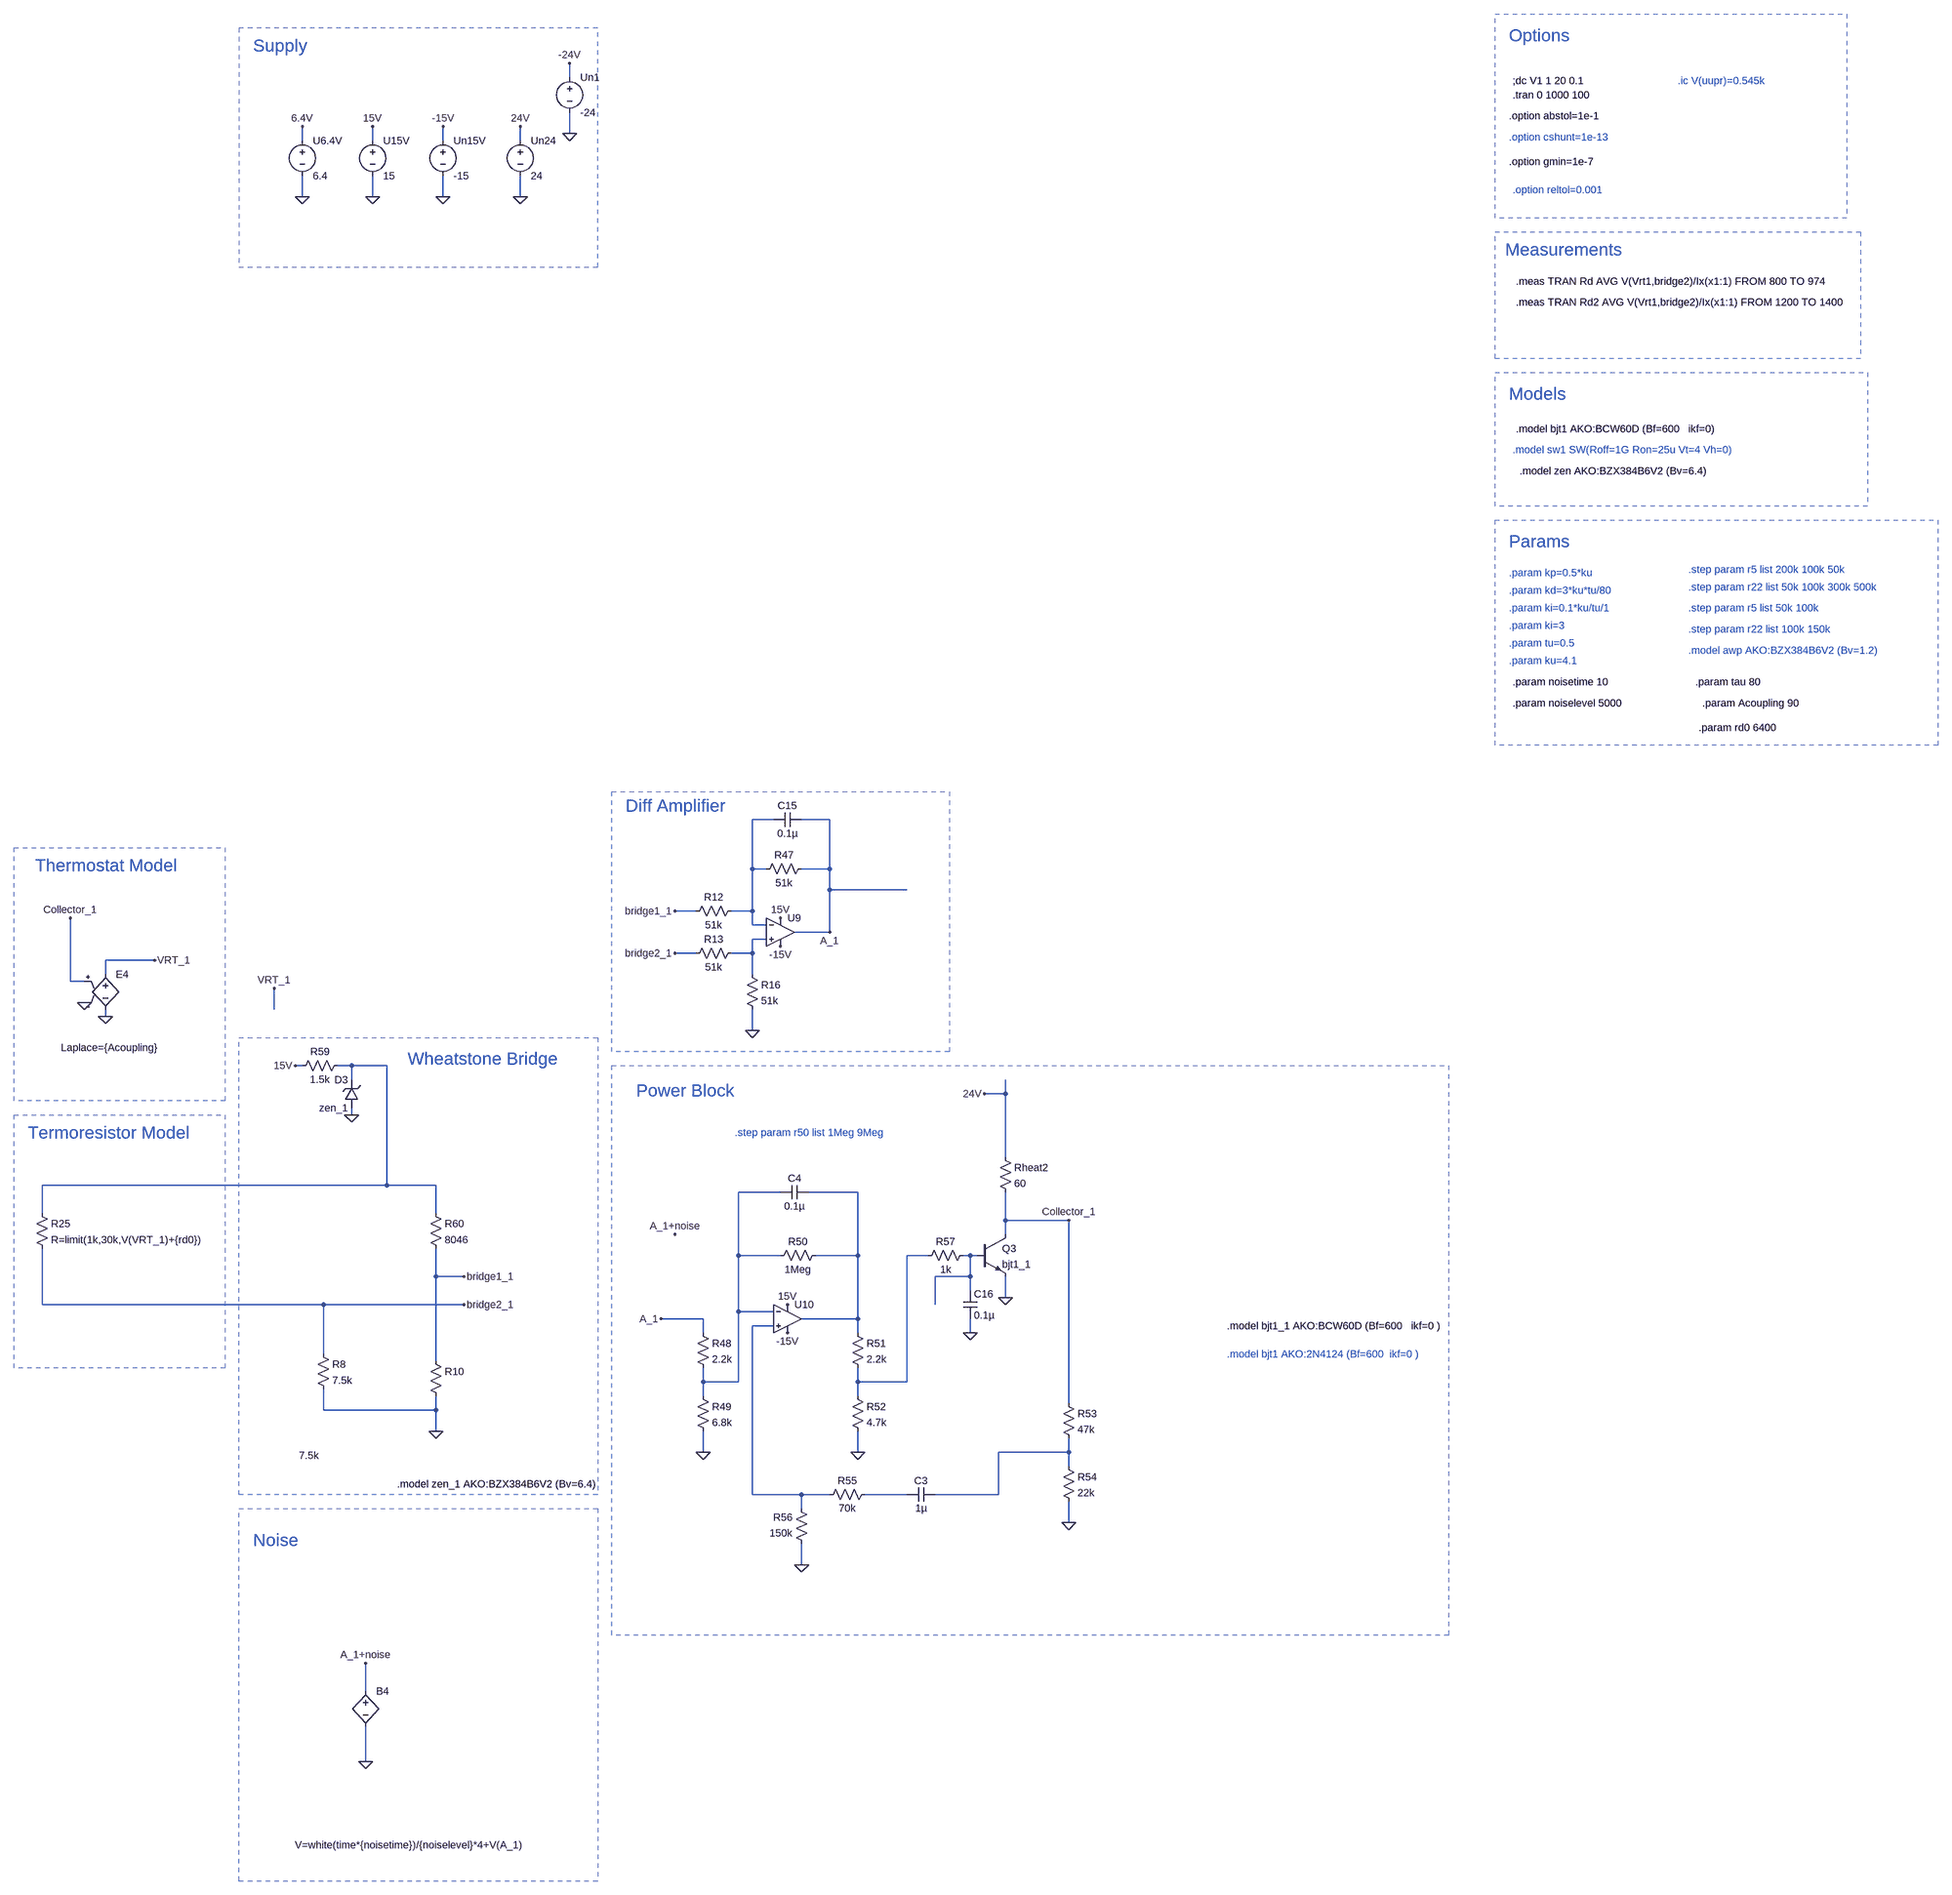
[diagram p0: schematic static.asc]
static.asc, the LTspice schematic file:
Version 4
SHEET 1 2196 8900
WIRE -1120 -672 -1120 -704
WIRE -1120 -544 -1120 -592
WIRE -1728 -528 -1728 -560
WIRE -1568 -528 -1568 -560
WIRE -1408 -528 -1408 -560
WIRE -1232 -528 -1232 -560
WIRE -1728 -400 -1728 -448
WIRE -1568 -400 -1568 -448
WIRE -1408 -400 -1408 -448
WIRE -1232 -400 -1232 -448
WIRE -656 3696 -704 3696
WIRE -528 3696 -592 3696
WIRE -704 3808 -704 3696
WIRE -672 3808 -704 3808
WIRE -528 3808 -528 3696
WIRE -528 3808 -592 3808
WIRE -528 3856 -528 3808
WIRE -352 3856 -528 3856
WIRE -832 3904 -880 3904
WIRE -704 3904 -704 3808
WIRE -704 3904 -752 3904
WIRE -704 3936 -704 3904
WIRE -672 3936 -704 3936
WIRE -528 3952 -528 3856
WIRE -528 3952 -608 3952
WIRE -672 3968 -704 3968
WIRE -832 4000 -880 4000
WIRE -704 4000 -704 3968
WIRE -704 4000 -752 4000
WIRE -2064 4016 -2176 4016
WIRE -2176 4048 -2176 4016
WIRE -704 4048 -704 4000
WIRE -2256 4064 -2256 3920
WIRE -2224 4064 -2256 4064
WIRE -1792 4128 -1792 4080
WIRE -2176 4144 -2176 4128
WIRE -704 4176 -704 4128
WIRE -1728 4256 -1744 4256
WIRE -1616 4256 -1648 4256
WIRE -1536 4256 -1616 4256
WIRE -1616 4288 -1616 4256
WIRE -128 4320 -128 4288
WIRE -128 4320 -176 4320
WIRE -1616 4368 -1616 4352
WIRE -128 4464 -128 4320
WIRE -1536 4528 -1536 4256
WIRE -1536 4528 -2320 4528
WIRE -1424 4528 -1536 4528
WIRE -640 4544 -736 4544
WIRE -464 4544 -576 4544
WIRE -2320 4592 -2320 4528
WIRE -1424 4592 -1424 4528
WIRE -128 4608 -128 4544
WIRE 16 4608 -128 4608
WIRE -128 4640 -128 4608
WIRE -736 4688 -736 4544
WIRE -640 4688 -736 4688
WIRE -464 4688 -464 4544
WIRE -464 4688 -560 4688
WIRE -304 4688 -352 4688
WIRE -208 4688 -224 4688
WIRE -192 4688 -208 4688
WIRE -1424 4736 -1424 4672
WIRE -1360 4736 -1424 4736
WIRE -208 4736 -208 4688
WIRE -208 4736 -288 4736
WIRE -208 4768 -208 4736
WIRE -128 4784 -128 4736
WIRE -2320 4800 -2320 4672
WIRE -1680 4800 -2320 4800
WIRE -1360 4800 -1680 4800
WIRE -288 4800 -288 4736
WIRE -736 4816 -736 4688
WIRE -656 4816 -736 4816
WIRE -816 4832 -912 4832
WIRE -464 4832 -464 4688
WIRE -464 4832 -592 4832
WIRE -656 4848 -704 4848
WIRE -816 4864 -816 4832
WIRE -464 4864 -464 4832
WIRE -208 4864 -208 4832
WIRE -1680 4912 -1680 4800
WIRE -1424 4928 -1424 4736
WIRE -816 4976 -816 4944
WIRE -736 4976 -736 4816
WIRE -736 4976 -816 4976
WIRE -464 4976 -464 4944
WIRE -352 4976 -352 4688
WIRE -352 4976 -464 4976
WIRE -816 5008 -816 4976
WIRE -464 5008 -464 4976
WIRE 16 5024 16 4608
WIRE -1680 5040 -1680 4992
WIRE -1424 5040 -1424 5008
WIRE -1424 5040 -1680 5040
WIRE -1424 5088 -1424 5040
WIRE -816 5136 -816 5088
WIRE -464 5136 -464 5088
WIRE 16 5136 16 5104
WIRE 16 5136 -144 5136
WIRE 16 5168 16 5136
WIRE -704 5232 -704 4848
WIRE -592 5232 -704 5232
WIRE -528 5232 -592 5232
WIRE -352 5232 -448 5232
WIRE -144 5232 -144 5136
WIRE -144 5232 -288 5232
WIRE -592 5264 -592 5232
WIRE 16 5296 16 5248
WIRE -592 5392 -592 5344
WIRE -1584 5680 -1584 5616
WIRE -1584 5840 -1584 5760
FLAG -1728 -400 0
FLAG -1728 -560 6.4V
FLAG -1568 -400 0
FLAG -1568 -560 15V
FLAG -1408 -400 0
FLAG -1408 -560 -15V
FLAG -1232 -400 0
FLAG -1232 -560 24V
FLAG -1424 5088 0
FLAG -640 3920 15V
FLAG -640 3984 -15V
FLAG -704 4176 0
FLAG -816 5136 0
FLAG -624 4864 -15V
FLAG -624 4800 15V
FLAG -464 5136 0
FLAG -128 4784 0
FLAG 16 5296 0
FLAG -592 5392 0
FLAG -208 4864 0
FLAG -1360 4736 bridge1_1
FLAG -1360 4800 bridge2_1
FLAG -880 3904 bridge1_1
FLAG -880 4000 bridge2_1
FLAG -528 3952 A_1
FLAG -912 4832 A_1
FLAG 16 4608 Collector_1
FLAG -2224 4112 0
FLAG -1792 4080 VRT_1
FLAG -2176 4144 0
FLAG -2064 4016 VRT_1
FLAG -2256 3920 Collector_1
FLAG -1744 4256 15V
FLAG -1616 4368 0
FLAG -176 4320 24V
FLAG -1584 5840 0
FLAG -1584 5616 A_1+noise
FLAG -880 4640 A_1+noise
FLAG -1120 -544 0
FLAG -1120 -704 -24V
DATAFLAG -400 3856 ""
DATAFLAG -816 4976 ""
DATAFLAG 16 5136 ""
SYMBOL voltage -1728 -544 R0
WINDOW 123 0 0 Left 0
WINDOW 39 0 0 Left 0
SYMATTR InstName U6.4V
SYMATTR Value 6.4
SYMBOL voltage -1568 -544 R0
WINDOW 123 0 0 Left 0
WINDOW 39 0 0 Left 0
SYMATTR InstName U15V
SYMATTR Value 15
SYMBOL voltage -1408 -544 R0
WINDOW 123 0 0 Left 0
WINDOW 39 0 0 Left 0
SYMATTR InstName Un15V
SYMATTR Value -15
SYMBOL voltage -1232 -544 R0
WINDOW 123 0 0 Left 0
WINDOW 39 0 0 Left 0
SYMATTR InstName Un24
SYMATTR Value 24
SYMBOL res -1696 4896 R0
SYMATTR InstName R8
SYMATTR Value 7.5k
SYMBOL res -1440 4912 R0
WINDOW 3 -296 231 Left 2
SYMATTR Value 7.5k
SYMATTR InstName R10
SYMBOL res -736 3888 R90
WINDOW 0 0 56 VBottom 2
WINDOW 3 32 56 VTop 2
SYMATTR InstName R12
SYMATTR Value 51k
SYMBOL res -736 3984 R90
WINDOW 0 0 56 VBottom 2
WINDOW 3 32 56 VTop 2
SYMATTR InstName R13
SYMATTR Value 51k
SYMBOL res -720 4032 R0
SYMATTR InstName R16
SYMATTR Value 51k
SYMBOL res -576 3792 R90
WINDOW 0 0 56 VBottom 2
WINDOW 3 32 56 VTop 2
SYMATTR InstName R47
SYMATTR Value 51k
SYMBOL res -832 4848 R0
SYMATTR InstName R48
SYMATTR Value 2.2k
SYMBOL res -832 4992 R0
SYMATTR InstName R49
SYMATTR Value 6.8k
SYMBOL res -544 4672 R90
WINDOW 0 0 56 VBottom 2
WINDOW 3 32 56 VTop 2
SYMATTR InstName R50
SYMATTR Value 1Meg
SYMBOL res -480 4848 R0
SYMATTR InstName R51
SYMATTR Value 2.2k
SYMBOL res -480 4992 R0
SYMATTR InstName R52
SYMATTR Value 4.7k
SYMBOL res -144 4448 R0
SYMATTR InstName Rheat2
SYMATTR Value 60
SYMBOL res 0 5008 R0
SYMATTR InstName R53
SYMATTR Value 47k
SYMBOL res 0 5152 R0
SYMATTR InstName R54
SYMATTR Value 22k
SYMBOL res -432 5216 R90
WINDOW 0 0 56 VBottom 2
WINDOW 3 32 56 VTop 2
SYMATTR InstName R55
SYMATTR Value 70k
SYMBOL res -576 5360 R180
WINDOW 0 36 76 Left 2
WINDOW 3 36 40 Left 2
SYMATTR InstName R56
SYMATTR Value 150k
SYMBOL res -208 4672 R90
WINDOW 0 0 56 VBottom 2
WINDOW 3 32 56 VTop 2
SYMATTR InstName R57
SYMATTR Value 1k
SYMBOL cap -288 5216 R90
WINDOW 0 0 32 VBottom 2
WINDOW 3 32 32 VTop 2
SYMATTR InstName C3
SYMATTR Value 1µ
SYMBOL cap -576 4528 R90
WINDOW 0 0 32 VBottom 2
WINDOW 3 32 32 VTop 2
SYMATTR InstName C4
SYMATTR Value 0.1µ
SYMBOL cap -592 3680 R90
WINDOW 0 0 32 VBottom 2
WINDOW 3 32 32 VTop 2
SYMATTR InstName C15
SYMATTR Value 0.1µ
SYMBOL cap -224 4768 R0
SYMATTR InstName C16
SYMATTR Value 0.1µ
SYMBOL e -2176 4032 R0
WINDOW 3 -101 183 Left 2
SYMATTR Value Laplace={Acoupling}
SYMATTR InstName E4
SYMBOL zener -1600 4352 R180
WINDOW 0 24 64 Left 2
WINDOW 3 24 0 Left 2
SYMATTR InstName D3
SYMATTR Value zen_1
SYMBOL res -1632 4240 R90
WINDOW 0 0 56 VBottom 2
WINDOW 3 32 56 VTop 2
SYMATTR InstName R59
SYMATTR Value 1.5k
SYMBOL npn -192 4640 R0
SYMATTR InstName Q3
SYMATTR Value bjt1_1
SYMBOL res -2336 4576 R0
SYMATTR InstName R25
SYMATTR Value R=limit(1k,30k,V(VRT_1)+{rd0})
SYMBOL res -1440 4576 R0
SYMATTR InstName R60
SYMATTR Value 8046
SYMBOL bv -1584 5664 R0
WINDOW 3 -161 366 Left 2
SYMATTR Value V=white(time*{noisetime})/{noiselevel}*4+V(A_1)
SYMATTR InstName B4
SYMBOL Opamps\\UniversalOpamp2 -640 3952 R0
SYMATTR InstName U9
SYMATTR Value2 Avol=250k GBW=10Meg Slew=10Meg
SYMBOL Opamps\\UniversalOpamp2 -624 4832 R0
SYMATTR InstName U10
SYMATTR Value2 Avol=250k GBW=10Meg Slew=10Meg
SYMBOL voltage -1120 -688 R0
WINDOW 123 0 0 Left 0
WINDOW 39 0 0 Left 0
SYMATTR InstName Un1
SYMATTR Value -24
TEXT 1224 -632 Left 2 !.tran 0 1000 100
TEXT -1840 -744 Left 4 ;Supply
TEXT 1224 176 Left 2 ;.model sw1 SW(Roff=1G Ron=25u Vt=4 Vh=0)
TEXT 1216 456 Left 2 ;.param kp=0.5*ku
TEXT 1216 496 Left 2 ;.param kd=3*ku*tu/80
TEXT 1216 536 Left 2 ;.param ki=0.1*ku/tu/1
TEXT 1216 616 Left 2 ;.param tu=0.5
TEXT 1216 656 Left 2 ;.param ku=4.1
TEXT 1216 576 Left 2 ;.param ki=3
TEXT 1600 -664 Left 2 ;.ic V(uupr)=0.545k
TEXT 1232 128 Left 2 !.model bjt1 AKO:BCW60D (Bf=600   ikf=0)
TEXT 1240 224 Left 2 !.model zen AKO:BZX384B6V2 (Bv=6.4)
TEXT 1224 -664 Left 2 !;dc V1 1 20 0.1
TEXT 1216 -584 Left 2 !.option abstol=1e-1
TEXT 1216 -536 Left 2 ;.option cshunt=1e-13
TEXT 1216 -480 Left 2 !.option gmin=1e-7
TEXT 1224 -416 Left 2 ;.option reltol=0.001
TEXT 1624 632 Left 2 ;.model awp AKO:BZX384B6V2 (Bv=1.2)
TEXT 1232 -208 Left 2 !.meas TRAN Rd AVG V(Vrt1,bridge2)/Ix(x1:1) FROM 800 TO 974
TEXT 1232 -160 Left 2 !.meas TRAN Rd2 AVG V(Vrt1,bridge2)/Ix(x1:1) FROM 1200 TO 1400
TEXT -1488 4240 Left 4 ;Wheatstone Bridge
TEXT -992 3664 Left 4 ;Diff Amplifier
TEXT -2336 3800 Left 4 ;Thermostat Model
TEXT -968 4312 Left 4 ;Power Block
TEXT 376 4848 Left 2 !.model bjt1_1 AKO:BCW60D (Bf=600   ikf=0 )
TEXT -1512 5208 Left 2 !.model zen_1 AKO:BZX384B6V2 (Bv=6.4)
TEXT 376 4912 Left 2 ;.model bjt1 AKO:2N4124 (Bf=600  ikf=0 )
TEXT 1624 448 Left 2 ;.step param r5 list 200k 100k 50k
TEXT 1624 488 Left 2 ;.step param r22 list 50k 100k 300k 500k
TEXT 1624 584 Left 2 ;.step param r22 list 100k 150k
TEXT 1624 536 Left 2 ;.step param r5 list 50k 100k
TEXT 1208 -280 Left 4 ;Measurements
TEXT 1216 -768 Left 4 ;Options
TEXT 1216 48 Left 4 ;Models
TEXT 1216 384 Left 4 ;Params
TEXT -2352 4408 Left 4 ;Termoresistor Model
TEXT 1224 704 Left 2 !.param noisetime 10
TEXT 1224 752 Left 2 !.param noiselevel 5000
TEXT -1840 5336 Left 4 ;Noise
TEXT -744 4408 Left 2 ;.step param r50 list 1Meg 9Meg
TEXT 1640 704 Left 2 !.param tau 80
TEXT 1656 752 Left 2 !.param Acoupling 90
TEXT 1648 808 Left 2 !.param rd0 6400
RECTANGLE Normal -1056 -784 -1872 -240 2
RECTANGLE Normal -1056 5232 -1872 4192 2
RECTANGLE Normal -256 4224 -1024 3632 2
RECTANGLE Normal -1904 4944 -2384 4368 2
RECTANGLE Normal -1904 4336 -2384 3760 2
RECTANGLE Normal 880 5552 -1024 4256 2
RECTANGLE Normal 2016 -32 1184 -320 2
RECTANGLE Normal 1984 -352 1184 -816 2
RECTANGLE Normal 2032 304 1184 0 2
RECTANGLE Normal 2192 848 1184 336 2
RECTANGLE Normal -1056 6112 -1872 5264 2

The netlist it stands for:
* static.asc
V§U6.4V 6.4V 0 6.4
V§U15V 15V 0 15
V§Un15V -15V 0 -15
V§Un24 24V 0 24
R8 bridge2_1 0 7.5k
R10 bridge1_1 0 7.5k
R12 N001 bridge1_1 51k
R13 N002 bridge2_1 51k
R16 N002 0 51k
R47 A_1 N001 51k
R48 A_1 N004 2.2k
R49 N004 0 6.8k
R50 N005 N004 1Meg
R51 N005 N006 2.2k
R52 N006 0 4.7k
Rheat2 24V Collector_1 60
R53 Collector_1 N009 47k
R54 N009 0 22k
R55 N010 N008 70k
R56 0 N008 150k
R57 N007 N006 1k
C3 N009 N010 1µ
C4 N005 N004 0.1µ
C15 A_1 N001 0.1µ
C16 N007 0 0.1µ
E4 VRT_1 0 Collector_1 0 Laplace={Acoupling}
D3 0 N003 zen_1
R59 N003 15V 1.5k
Q3 Collector_1 N007 0 0 bjt1_1
R25 N003 bridge2_1 R=limit(1k,30k,V(VRT_1)+{rd0})
R60 N003 bridge1_1 8046
B4 A_1+noise 0 V=white(time*{noisetime})/{noiselevel}*4+V(A_1)
XU9 N002 N001 15V -15V A_1 level.2 Avol=250k GBW=10Meg Slew=10Meg ilimit=25m rail=0 Vos=0 phimargin=45 en=0 enk=0 in=0 ink=0 Rin=500Meg  ; pins IN+ IN- V+ V- OUT
XU10 N008 N004 15V -15V N005 level.2 Avol=250k GBW=10Meg Slew=10Meg ilimit=25m rail=0 Vos=0 phimargin=45 en=0 enk=0 in=0 ink=0 Rin=500Meg  ; pins IN+ IN- V+ V- OUT
V§Un1 -24V 0 -24
.model D D
.lib standard.dio
.model NPN NPN
.model PNP PNP
.lib standard.bjt
.tran 0 1000 100
* Supply
* .model sw1 SW(Roff=1G Ron=25u Vt=4 Vh=0)
* .param kp=0.5*ku
* .param kd=3*ku*tu/80
* .param ki=0.1*ku/tu/1
* .param tu=0.5
* .param ku=4.1
* .param ki=3
* .ic V(uupr)=0.545k
.model bjt1 AKO:BCW60D (Bf=600   ikf=0)
.model zen AKO:BZX384B6V2 (Bv=6.4)
;dc V1 1 20 0.1
.option abstol=1e-1
* .option cshunt=1e-13
.option gmin=1e-7
* .option reltol=0.001
* .model awp AKO:BZX384B6V2 (Bv=1.2)
.meas TRAN Rd AVG V(Vrt1,bridge2)/Ix(x1:1) FROM 800 TO 974
.meas TRAN Rd2 AVG V(Vrt1,bridge2)/Ix(x1:1) FROM 1200 TO 1400
* Wheatstone Bridge
* Diff Amplifier
* Thermostat Model
* Power Block
.model bjt1_1 AKO:BCW60D (Bf=600   ikf=0 )
.model zen_1 AKO:BZX384B6V2 (Bv=6.4)
* .model bjt1 AKO:2N4124 (Bf=600  ikf=0 )
* .step param r5 list 200k 100k 50k
* .step param r22 list 50k 100k 300k 500k
* .step param r22 list 100k 150k
* .step param r5 list 50k 100k
* Measurements
* Options
* Models
* Params
* Termoresistor Model
.param noisetime 10
.param noiselevel 5000
* Noise
* .step param r50 list 1Meg 9Meg
.param tau 80
.param Acoupling 90
.param rd0 6400
.lib UniversalOpamps2.sub
.backanno
.end